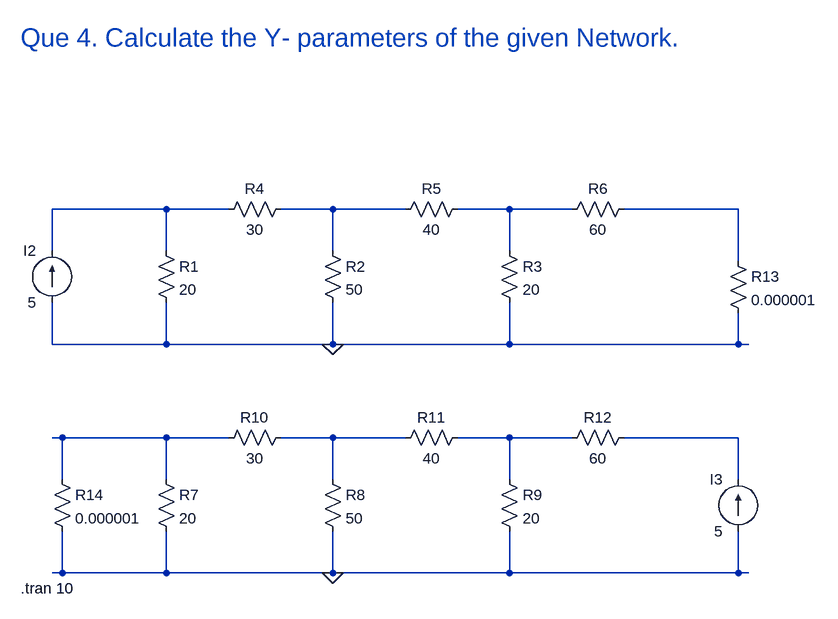
[diagram p0: schematic 4_Dheerendra_23EE019_AC_Two_port.asc]
4_Dheerendra_23EE019_AC_Two_port.asc, the LTspice schematic file:
Version 4
SHEET 1 880 936
WIRE -656 336 -832 336
WIRE -560 336 -656 336
WIRE -400 336 -480 336
WIRE -288 336 -400 336
WIRE -128 336 -208 336
WIRE -32 336 -128 336
WIRE 224 336 48 336
WIRE -832 400 -832 336
WIRE -656 400 -656 336
WIRE -400 400 -400 336
WIRE -128 400 -128 336
WIRE 224 416 224 336
WIRE -832 544 -832 480
WIRE -656 544 -656 480
WIRE -656 544 -832 544
WIRE -400 544 -400 480
WIRE -400 544 -656 544
WIRE -128 544 -128 480
WIRE -128 544 -400 544
WIRE 224 544 224 496
WIRE 224 544 -128 544
WIRE 240 544 224 544
WIRE -816 688 -832 688
WIRE -656 688 -816 688
WIRE -560 688 -656 688
WIRE -400 688 -480 688
WIRE -288 688 -400 688
WIRE -128 688 -208 688
WIRE -32 688 -128 688
WIRE 224 688 48 688
WIRE -816 752 -816 688
WIRE -656 752 -656 688
WIRE -400 752 -400 688
WIRE -128 752 -128 688
WIRE 224 752 224 688
WIRE -816 896 -816 832
WIRE -816 896 -832 896
WIRE -656 896 -656 832
WIRE -656 896 -816 896
WIRE -400 896 -400 832
WIRE -400 896 -656 896
WIRE -128 896 -128 832
WIRE -128 896 -400 896
WIRE 224 896 224 832
WIRE 224 896 -128 896
WIRE 240 896 224 896
FLAG -400 544 0
FLAG -400 896 0
SYMBOL res -672 384 R0
SYMATTR InstName R1
SYMATTR Value 20
SYMBOL res -416 384 R0
SYMATTR InstName R2
SYMATTR Value 50
SYMBOL res -144 384 R0
SYMATTR InstName R3
SYMATTR Value 20
SYMBOL res -464 320 R90
WINDOW 0 0 56 VBottom 2
WINDOW 3 32 56 VTop 2
SYMATTR InstName R4
SYMATTR Value 30
SYMBOL res -192 320 R90
WINDOW 0 0 56 VBottom 2
WINDOW 3 32 56 VTop 2
SYMATTR InstName R5
SYMATTR Value 40
SYMBOL res 64 320 R90
WINDOW 0 0 56 VBottom 2
WINDOW 3 32 56 VTop 2
SYMATTR InstName R6
SYMATTR Value 60
SYMBOL res -672 736 R0
SYMATTR InstName R7
SYMATTR Value 20
SYMBOL res -416 736 R0
SYMATTR InstName R8
SYMATTR Value 50
SYMBOL res -144 736 R0
SYMATTR InstName R9
SYMATTR Value 20
SYMBOL res -464 672 R90
WINDOW 0 0 56 VBottom 2
WINDOW 3 32 56 VTop 2
SYMATTR InstName R10
SYMATTR Value 30
SYMBOL res -192 672 R90
WINDOW 0 0 56 VBottom 2
WINDOW 3 32 56 VTop 2
SYMATTR InstName R11
SYMATTR Value 40
SYMBOL res 64 672 R90
WINDOW 0 0 56 VBottom 2
WINDOW 3 32 56 VTop 2
SYMATTR InstName R12
SYMATTR Value 60
SYMBOL current -832 480 R180
WINDOW 0 24 80 Left 2
WINDOW 3 24 0 Left 2
WINDOW 123 0 0 Left 0
WINDOW 39 0 0 Left 0
SYMATTR InstName I2
SYMATTR Value 5
SYMBOL current 224 832 R180
WINDOW 0 24 80 Left 2
WINDOW 3 24 0 Left 2
WINDOW 123 0 0 Left 0
WINDOW 39 0 0 Left 0
SYMATTR InstName I3
SYMATTR Value 5
SYMBOL res 208 400 R0
SYMATTR InstName R13
SYMATTR Value 0.000001
SYMBOL res -832 736 R0
SYMATTR InstName R14
SYMATTR Value 0.000001
TEXT -880 72 Left 4 ;Que 4. Calculate the Y- parameters of the given Network.
TEXT -880 920 Left 2 !.tran 10

The netlist it stands for:
* 4_Dheerendra_23EE019_AC_Two_port.asc
R1 N001 0 20
R2 N002 0 50
R3 N003 0 20
R4 N002 N001 30
R5 N003 N002 40
R6 N004 N003 60
R7 N005 0 20
R8 N006 0 50
R9 N007 0 20
R10 N006 N005 30
R11 N007 N006 40
R12 N008 N007 60
I2 0 N001 5
I3 0 N008 5
R13 N004 0 0.000001
R14 N005 0 0.000001
* Que 4. Calculate the Y- parameters of the given Network.
.tran 10
.backanno
.end